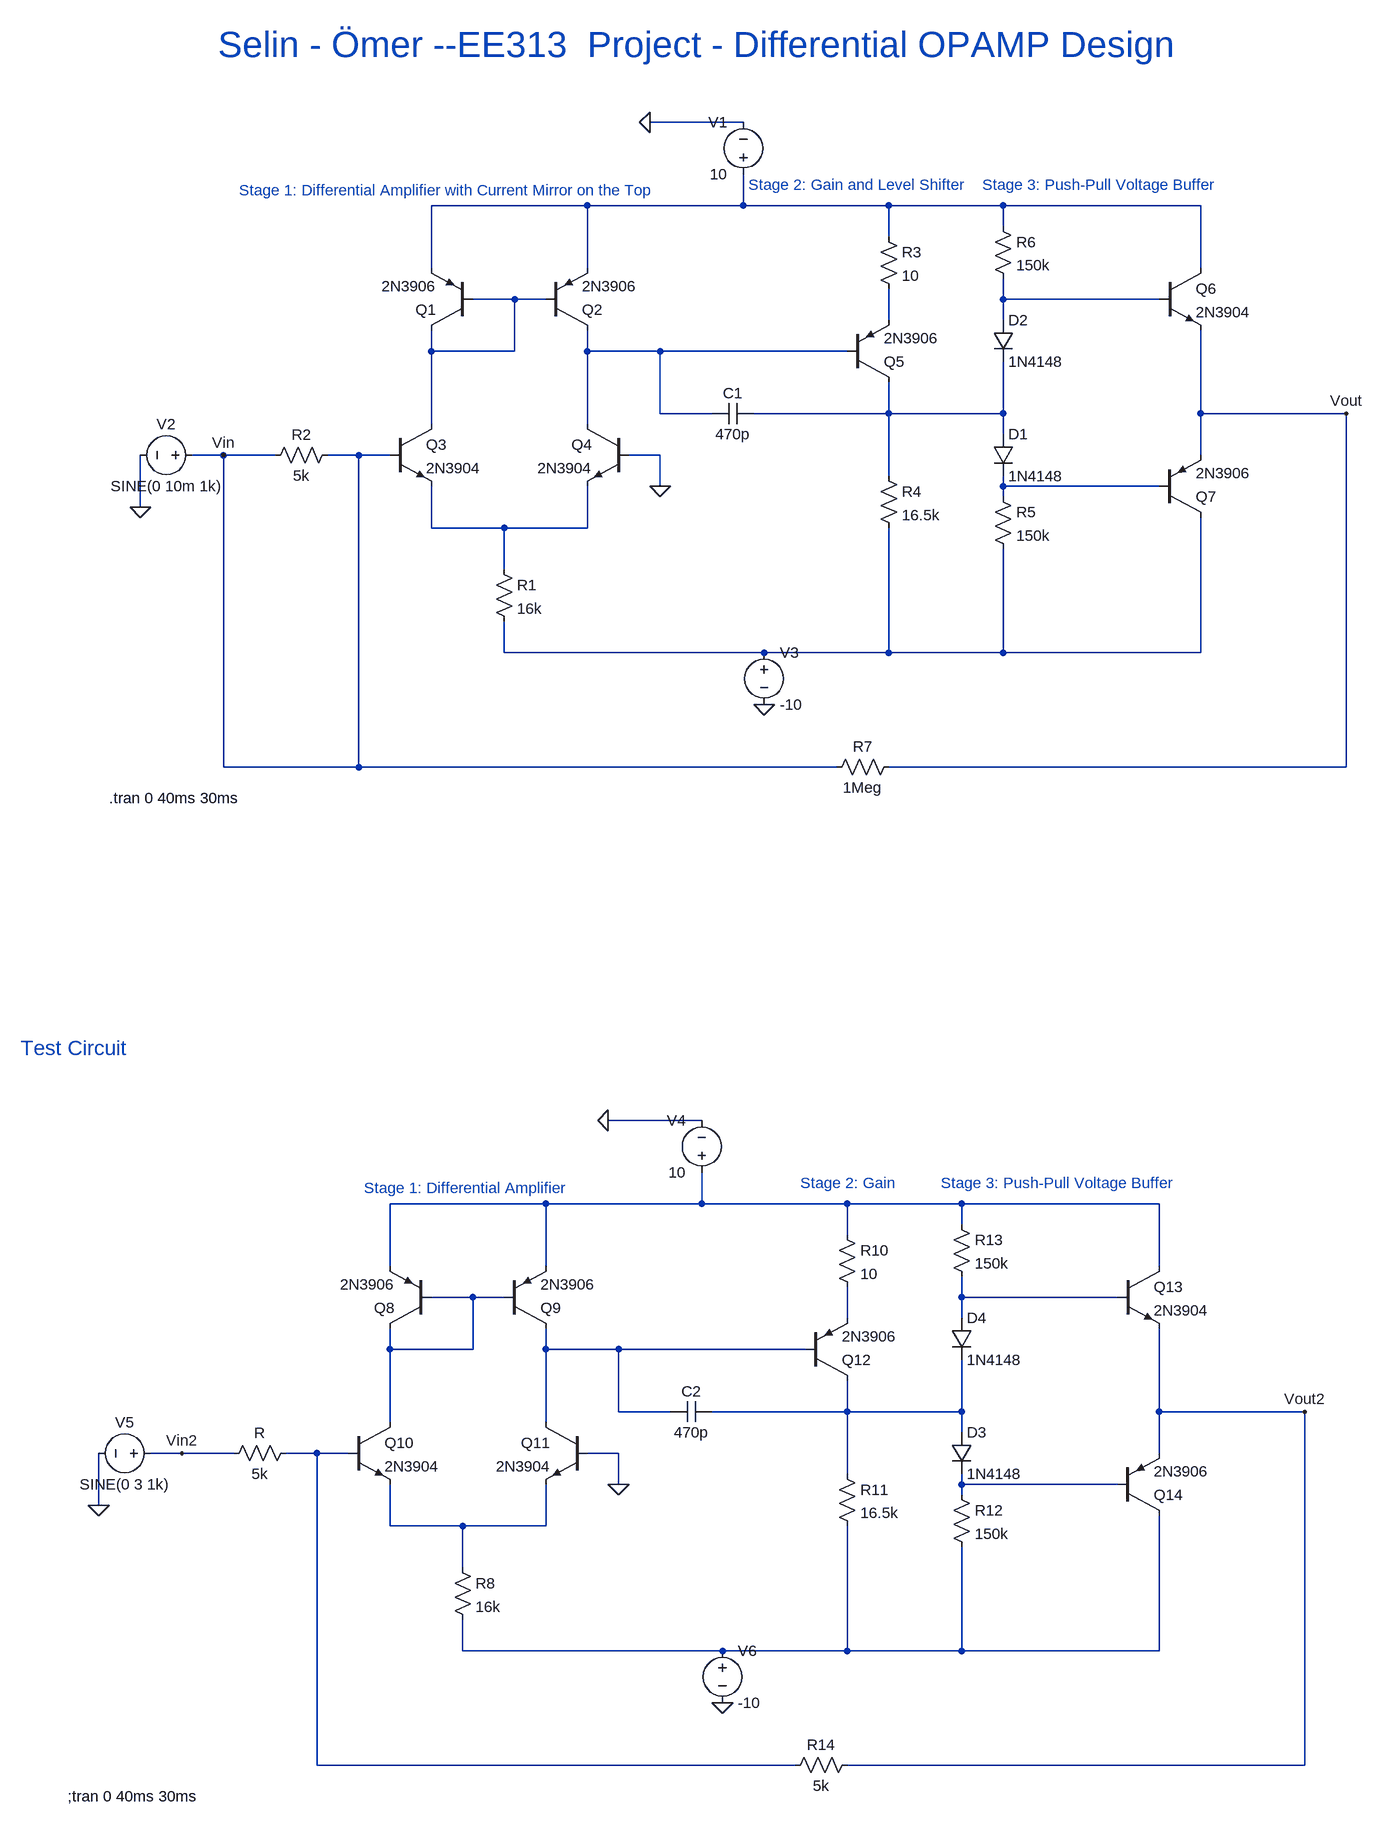
[diagram p0: schematic Draft1.asc]
Draft1.asc, the LTspice schematic file:
Version 4
SHEET 1 3516 2560
WIRE 192 -32 48 -32
WIRE -48 96 -288 96
WIRE 192 96 192 48
WIRE 192 96 -48 96
WIRE 416 96 192 96
WIRE 592 96 416 96
WIRE 896 96 592 96
WIRE 592 128 592 96
WIRE 416 144 416 96
WIRE -288 192 -288 96
WIRE -48 192 -48 96
WIRE 896 192 896 96
WIRE -160 240 -224 240
WIRE -112 240 -160 240
WIRE 592 240 592 208
WIRE 832 240 592 240
WIRE 416 272 416 224
WIRE 592 272 592 240
WIRE -288 320 -288 288
WIRE -160 320 -160 240
WIRE -160 320 -288 320
WIRE -48 320 -48 288
WIRE 64 320 -48 320
WIRE 352 320 64 320
WIRE 64 416 64 320
WIRE 144 416 64 416
WIRE 416 416 416 368
WIRE 416 416 208 416
WIRE 592 416 592 336
WIRE 592 416 416 416
WIRE 896 416 896 288
WIRE 1120 416 896 416
WIRE -288 432 -288 320
WIRE -48 432 -48 320
WIRE 592 448 592 416
WIRE -608 480 -656 480
WIRE -528 480 -608 480
WIRE -400 480 -448 480
WIRE -352 480 -400 480
WIRE 64 480 16 480
WIRE 896 480 896 416
WIRE 416 512 416 416
WIRE 64 528 64 480
WIRE 592 528 592 512
WIRE 832 528 592 528
WIRE 592 544 592 528
WIRE -736 560 -736 480
WIRE -288 592 -288 528
WIRE -176 592 -288 592
WIRE -48 592 -48 528
WIRE -48 592 -176 592
WIRE -176 656 -176 592
WIRE -176 784 -176 736
WIRE 224 784 -176 784
WIRE 416 784 416 592
WIRE 416 784 224 784
WIRE 592 784 592 624
WIRE 592 784 416 784
WIRE 896 784 896 576
WIRE 896 784 592 784
WIRE -608 960 -608 480
WIRE -400 960 -400 480
WIRE -400 960 -608 960
WIRE 336 960 -400 960
WIRE 1120 960 1120 416
WIRE 1120 960 416 960
WIRE 128 1504 -16 1504
WIRE -112 1632 -352 1632
WIRE 128 1632 128 1584
WIRE 128 1632 -112 1632
WIRE 352 1632 128 1632
WIRE 528 1632 352 1632
WIRE 832 1632 528 1632
WIRE 528 1664 528 1632
WIRE 352 1680 352 1632
WIRE -352 1728 -352 1632
WIRE -112 1728 -112 1632
WIRE 832 1728 832 1632
WIRE -224 1776 -288 1776
WIRE -176 1776 -224 1776
WIRE 528 1776 528 1744
WIRE 768 1776 528 1776
WIRE 352 1808 352 1760
WIRE 528 1808 528 1776
WIRE -352 1856 -352 1824
WIRE -224 1856 -224 1776
WIRE -224 1856 -352 1856
WIRE -112 1856 -112 1824
WIRE 0 1856 -112 1856
WIRE 288 1856 0 1856
WIRE 0 1952 0 1856
WIRE 80 1952 0 1952
WIRE 352 1952 352 1904
WIRE 352 1952 144 1952
WIRE 528 1952 528 1872
WIRE 528 1952 352 1952
WIRE 832 1952 832 1824
WIRE 1056 1952 832 1952
WIRE -352 1968 -352 1856
WIRE -112 1968 -112 1856
WIRE 528 1984 528 1952
WIRE -672 2016 -720 2016
WIRE -592 2016 -672 2016
WIRE -464 2016 -512 2016
WIRE -416 2016 -464 2016
WIRE 0 2016 -48 2016
WIRE 832 2016 832 1952
WIRE 352 2048 352 1952
WIRE 0 2064 0 2016
WIRE 528 2064 528 2048
WIRE 768 2064 528 2064
WIRE 528 2080 528 2064
WIRE -800 2096 -800 2016
WIRE -352 2128 -352 2064
WIRE -240 2128 -352 2128
WIRE -112 2128 -112 2064
WIRE -112 2128 -240 2128
WIRE -240 2192 -240 2128
WIRE -240 2320 -240 2272
WIRE 160 2320 -240 2320
WIRE 352 2320 352 2128
WIRE 352 2320 160 2320
WIRE 528 2320 528 2160
WIRE 528 2320 352 2320
WIRE 832 2320 832 2112
WIRE 832 2320 528 2320
WIRE -464 2496 -464 2016
WIRE 272 2496 -464 2496
WIRE 1056 2496 1056 1952
WIRE 1056 2496 352 2496
FLAG 48 -32 0
FLAG -736 560 0
FLAG 64 528 0
FLAG 224 864 0
FLAG -608 480 Vin
FLAG 1120 416 Vout
FLAG -16 1504 0
FLAG -800 2096 0
FLAG 0 2064 0
FLAG 160 2400 0
FLAG -672 2016 Vin2
FLAG 1056 1952 Vout2
SYMBOL voltage 192 64 R180
WINDOW 0 24 96 Left 2
WINDOW 3 24 16 Left 2
WINDOW 123 0 0 Left 0
WINDOW 39 0 0 Left 0
SYMATTR InstName V1
SYMATTR Value 10
SYMBOL pnp -224 288 R180
SYMATTR InstName Q1
SYMATTR Value 2N3906
SYMBOL pnp -112 288 M180
SYMATTR InstName Q2
SYMATTR Value 2N3906
SYMBOL npn -352 432 R0
SYMATTR InstName Q3
SYMATTR Value 2N3904
SYMBOL npn 16 432 M0
SYMATTR InstName Q4
SYMATTR Value 2N3904
SYMBOL res -192 640 R0
SYMATTR InstName R1
SYMATTR Value 16k
SYMBOL res -432 464 R90
WINDOW 0 0 56 VBottom 2
WINDOW 3 32 56 VTop 2
SYMATTR InstName R2
SYMATTR Value 5k
SYMBOL voltage -640 480 R90
WINDOW 0 -32 56 VBottom 2
WINDOW 3 32 56 VTop 2
WINDOW 123 0 0 Left 0
WINDOW 39 0 0 Left 0
SYMATTR InstName V2
SYMATTR Value SINE(0 10m 1k)
SYMBOL pnp 352 368 M180
SYMATTR InstName Q5
SYMATTR Value 2N3906
SYMBOL res 400 128 R0
SYMATTR InstName R3
SYMATTR Value 10
SYMBOL cap 208 400 R90
WINDOW 0 0 32 VBottom 2
WINDOW 3 32 32 VTop 2
SYMATTR InstName C1
SYMATTR Value 470p
SYMBOL res 400 496 R0
SYMATTR InstName R4
SYMATTR Value 16.5k
SYMBOL res 576 528 R0
SYMATTR InstName R5
SYMATTR Value 150k
SYMBOL diode 576 448 R0
SYMATTR InstName D1
SYMATTR Value 1N4148
SYMBOL res 576 112 R0
SYMATTR InstName R6
SYMATTR Value 150k
SYMBOL diode 576 272 R0
SYMATTR InstName D2
SYMATTR Value 1N4148
SYMBOL npn 832 192 R0
SYMATTR InstName Q6
SYMATTR Value 2N3904
SYMBOL pnp 832 576 M180
SYMATTR InstName Q7
SYMATTR Value 2N3906
SYMBOL res 432 944 R90
WINDOW 0 0 56 VBottom 2
WINDOW 3 32 56 VTop 2
SYMATTR InstName R7
SYMATTR Value 1Meg
SYMBOL voltage 224 768 R0
WINDOW 123 0 0 Left 0
WINDOW 39 0 0 Left 0
SYMATTR InstName V3
SYMATTR Value -10
SYMBOL voltage 128 1600 R180
WINDOW 0 24 96 Left 2
WINDOW 3 24 16 Left 2
WINDOW 123 0 0 Left 0
WINDOW 39 0 0 Left 0
SYMATTR InstName V4
SYMATTR Value 10
SYMBOL pnp -288 1824 R180
SYMATTR InstName Q8
SYMATTR Value 2N3906
SYMBOL pnp -176 1824 M180
SYMATTR InstName Q9
SYMATTR Value 2N3906
SYMBOL npn -416 1968 R0
SYMATTR InstName Q10
SYMATTR Value 2N3904
SYMBOL npn -48 1968 M0
SYMATTR InstName Q11
SYMATTR Value 2N3904
SYMBOL res -256 2176 R0
SYMATTR InstName R8
SYMATTR Value 16k
SYMBOL res -496 2000 R90
WINDOW 0 0 56 VBottom 2
WINDOW 3 32 56 VTop 2
SYMATTR InstName R
SYMATTR Value 5k
SYMBOL voltage -704 2016 R90
WINDOW 0 -32 56 VBottom 2
WINDOW 3 32 56 VTop 2
WINDOW 123 0 0 Left 0
WINDOW 39 0 0 Left 0
SYMATTR InstName V5
SYMATTR Value SINE(0 3 1k)
SYMBOL pnp 288 1904 M180
SYMATTR InstName Q12
SYMATTR Value 2N3906
SYMBOL res 336 1664 R0
SYMATTR InstName R10
SYMATTR Value 10
SYMBOL cap 144 1936 R90
WINDOW 0 0 32 VBottom 2
WINDOW 3 32 32 VTop 2
SYMATTR InstName C2
SYMATTR Value 470p
SYMBOL res 336 2032 R0
SYMATTR InstName R11
SYMATTR Value 16.5k
SYMBOL res 512 2064 R0
SYMATTR InstName R12
SYMATTR Value 150k
SYMBOL diode 512 1984 R0
SYMATTR InstName D3
SYMATTR Value 1N4148
SYMBOL res 512 1648 R0
SYMATTR InstName R13
SYMATTR Value 150k
SYMBOL diode 512 1808 R0
SYMATTR InstName D4
SYMATTR Value 1N4148
SYMBOL npn 768 1728 R0
SYMATTR InstName Q13
SYMATTR Value 2N3904
SYMBOL pnp 768 2112 M180
SYMATTR InstName Q14
SYMATTR Value 2N3906
SYMBOL res 368 2480 R90
WINDOW 0 0 56 VBottom 2
WINDOW 3 32 56 VTop 2
SYMATTR InstName R14
SYMATTR Value 5k
SYMBOL voltage 160 2304 R0
WINDOW 123 0 0 Left 0
WINDOW 39 0 0 Left 0
SYMATTR InstName V6
SYMATTR Value -10
TEXT -784 1008 Left 2 !.tran 0 40ms 30ms
TEXT -616 -152 Left 5 ;Selin - Ömer --EE313  Project - Differential OPAMP Design
TEXT -584 72 Left 2 ;Stage 1: Differential Amplifier with Current Mirror on the Top
TEXT 200 64 Left 2 ;Stage 2: Gain and Level Shifter
TEXT 560 64 Left 2 ;Stage 3: Push-Pull Voltage Buffer
TEXT -848 2544 Left 2 !;tran 0 40ms 30ms
TEXT -392 1608 Left 2 ;Stage 1: Differential Amplifier
TEXT 280 1600 Left 2 ;Stage 2: Gain
TEXT 496 1600 Left 2 ;Stage 3: Push-Pull Voltage Buffer
TEXT -920 1392 Left 3 ;Test Circuit

The netlist it stands for:
* Draft1.asc
V1 N001 0 10
Q1 N002 N002 N001 0 2N3906
Q2 N005 N002 N001 0 2N3906
Q3 N002 Vin N008 0 2N3904
Q4 N005 0 N008 0 2N3904
R1 N008 N009 16k
R2 Vin Vin 5k
V2 Vin 0 SINE(0 10m 1k)
Q5 N006 N005 N004 0 2N3906
R3 N001 N004 10
C1 N006 N005 470p
R4 N006 N009 16.5k
R5 N007 N009 150k
D1 N006 N007 1N4148
R6 N001 N003 150k
D2 N003 N006 1N4148
Q6 N001 N003 Vout 0 2N3904
Q7 N009 N007 Vout 0 2N3906
R7 Vout Vin 1Meg
V3 N009 0 -10
V4 N010 0 10
Q8 N011 N011 N010 0 2N3906
Q9 N014 N011 N010 0 2N3906
Q10 N011 N016 N018 0 2N3904
Q11 N014 0 N018 0 2N3904
R8 N018 N019 16k
R N016 Vin2 5k
V5 Vin2 0 SINE(0 3 1k)
Q12 N015 N014 N013 0 2N3906
R10 N010 N013 10
C2 N015 N014 470p
R11 N015 N019 16.5k
R12 N017 N019 150k
D3 N015 N017 1N4148
R13 N010 N012 150k
D4 N012 N015 1N4148
Q13 N010 N012 Vout2 0 2N3904
Q14 N019 N017 Vout2 0 2N3906
R14 Vout2 N016 5k
V6 N019 0 -10
.model D D
.lib standard.dio
.model NPN NPN
.model PNP PNP
.lib standard.bjt
.tran 0 40ms 30ms
* Selin - Ömer --EE313  Project - Differential OPAMP Design
* Stage 1: Differential Amplifier with Current Mirror on the Top
* Stage 2: Gain and Level Shifter
* Stage 3: Push-Pull Voltage Buffer
;tran 0 40ms 30ms
* Stage 1: Differential Amplifier
* Stage 2: Gain
* Stage 3: Push-Pull Voltage Buffer
* Test Circuit
.backanno
.end